# Altium schematic sheet radio.SchDoc
size A4
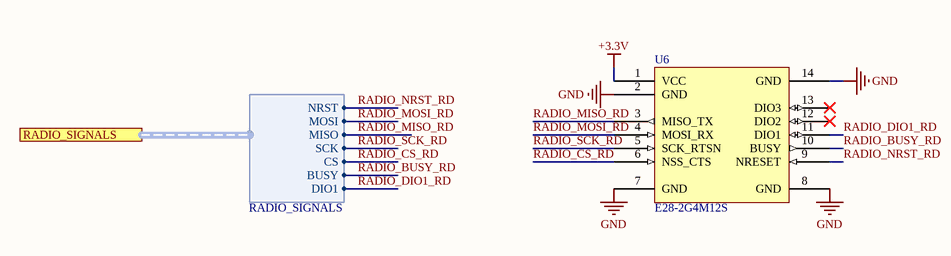
[diagram p0: radio.SchDoc]

## Parts
U6  E28-2G4M12S  [PE28(2G4M12S)]

## Ports
RADIO_SIGNALS (harness RADIO_SIGNALS)

## Harnesses
RADIO_SIGNALS: CS, SCK, MISO, MOSI, NRST, BUSY, DIO1

## Nets
+3.3V: U6.1(VCC)
GND: U6.2(GND) U6.7(GND) U6.8(GND) U6.14(GND)
RADIO_BUSY_RD: U6.10(BUSY) ; port RADIO_SIGNALS.BUSY
RADIO_CS_RD: U6.6(NSS_CTS) ; port RADIO_SIGNALS.CS
RADIO_DIO1_RD: U6.11(DIO1) ; port RADIO_SIGNALS.DIO1
RADIO_MISO_RD: U6.3(MISO_TX) ; port RADIO_SIGNALS.MISO
RADIO_MOSI_RD: U6.4(MOSI_RX) ; port RADIO_SIGNALS.MOSI
RADIO_NRST_RD: U6.9(NRESET) ; port RADIO_SIGNALS.NRST
RADIO_SCK_RD: U6.5(SCK_RTSN) ; port RADIO_SIGNALS.SCK

Not connected (* = marked no-connect by the designer): U6 12(DIO2)* 13(DIO3)*

## Library data of the parts
U6 = E28-2G4M12S: 2.4GHz LoRa modules; Part Number: E28-2G4M12S